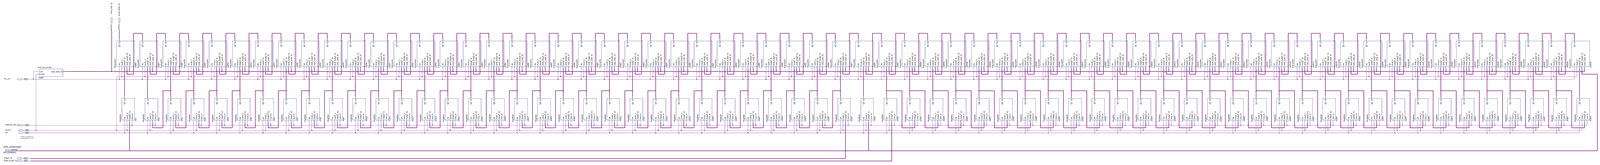
[diagram p0: schematic sheet, whole]
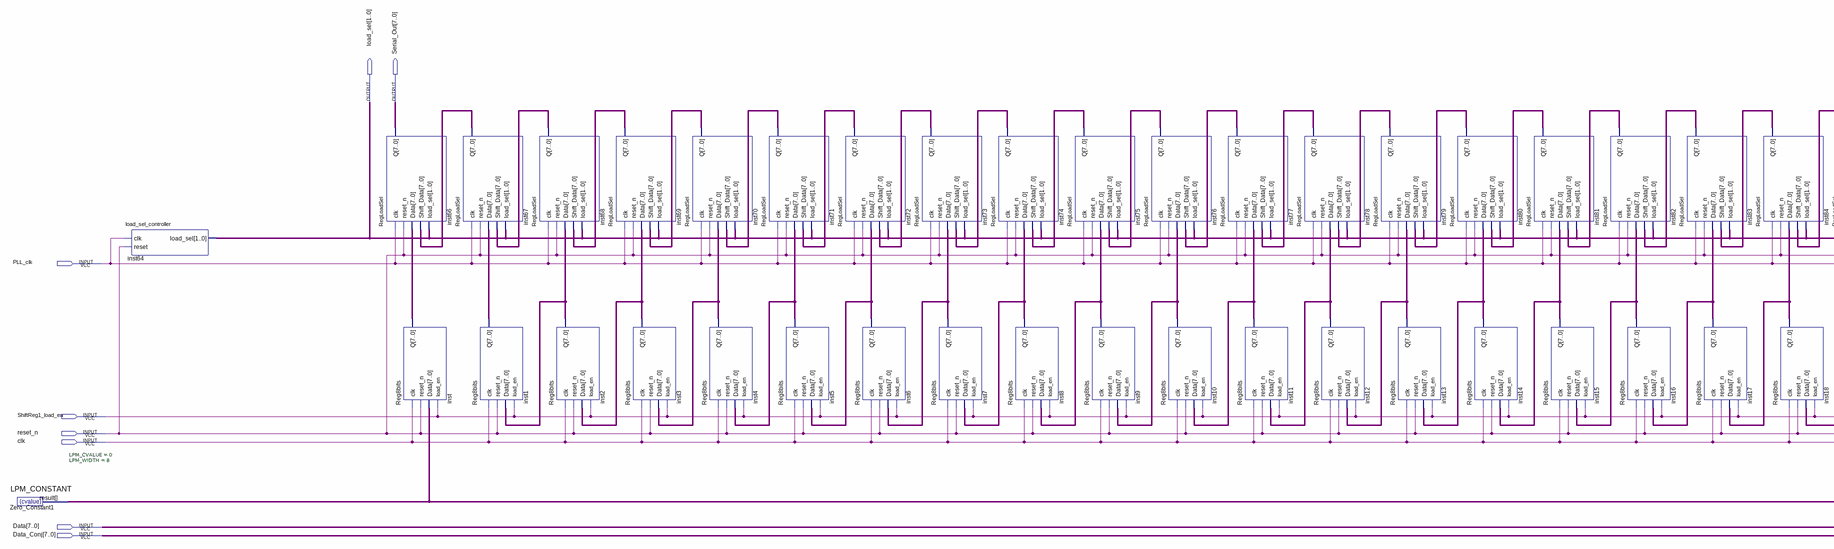
[diagram p1: schematic sheet, left part]
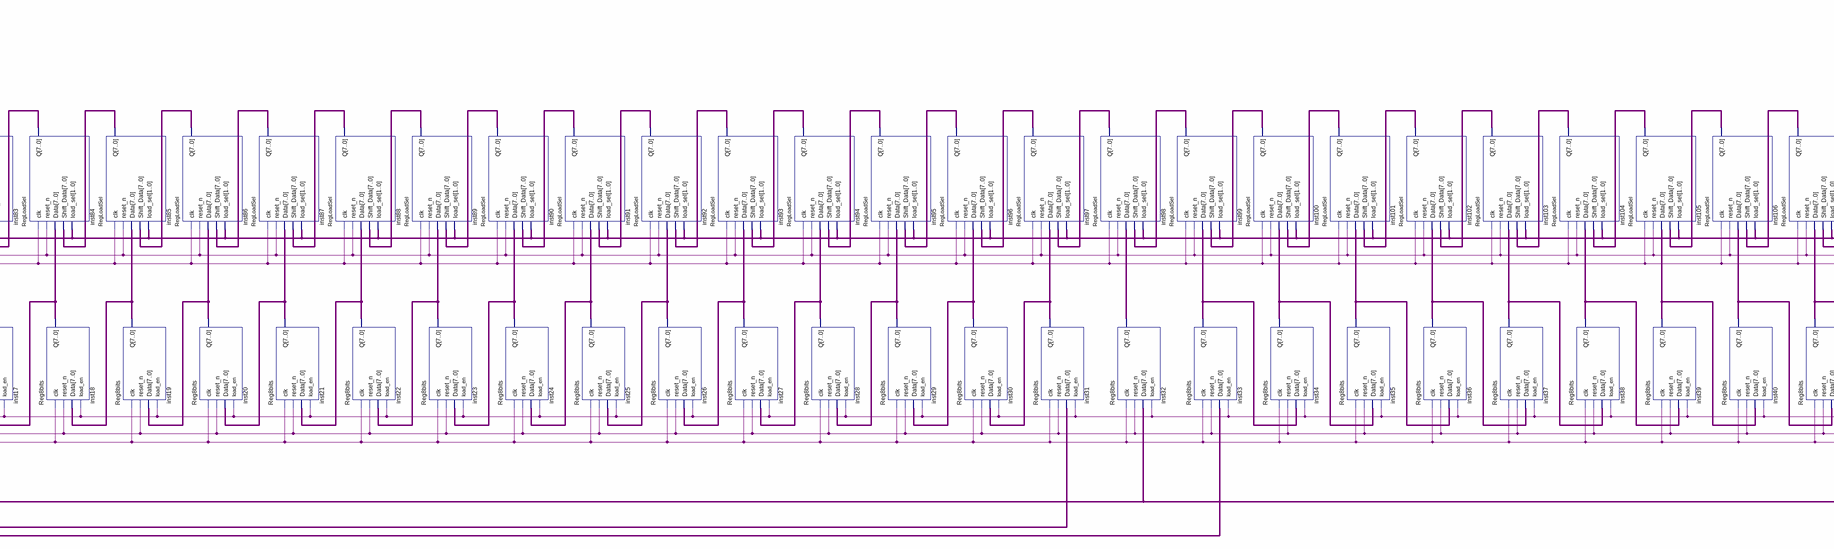
[diagram p2: schematic sheet, centre part]
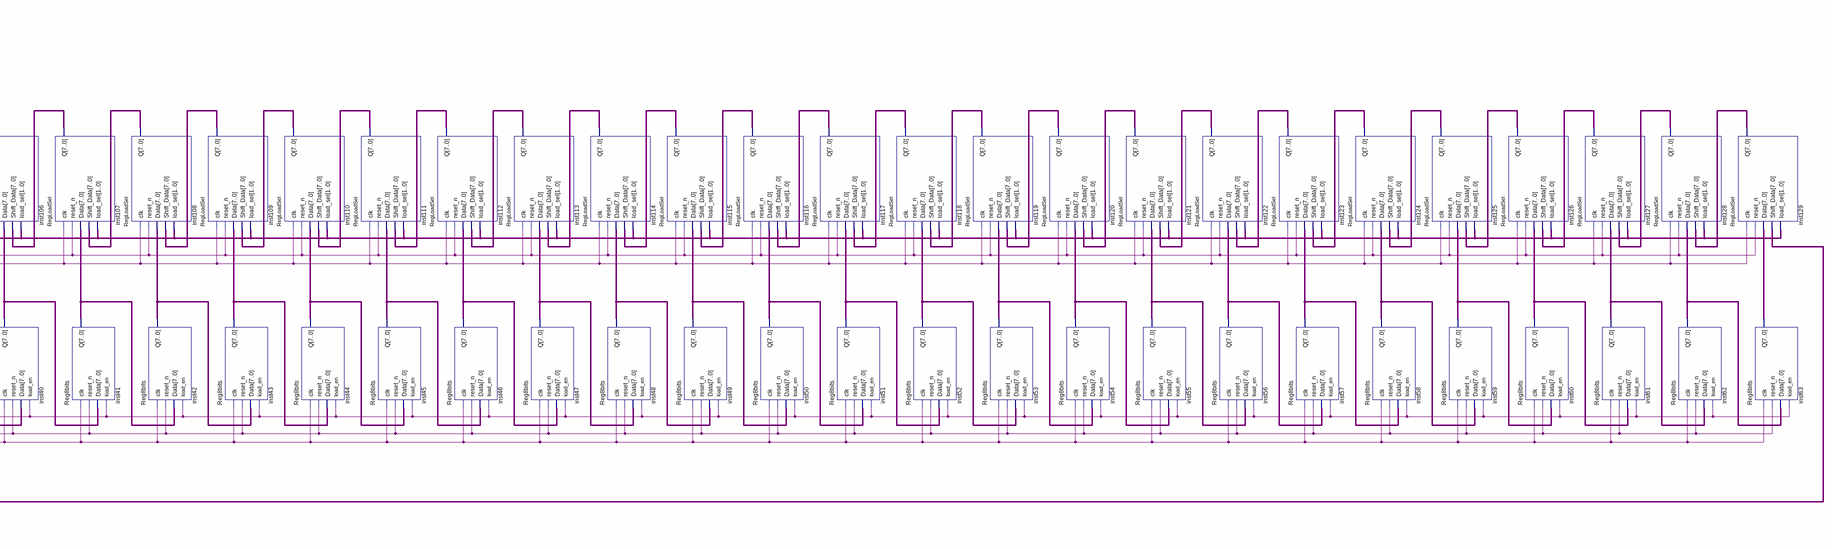
[diagram p3: schematic sheet, right part]
// Quartus schematic Sorter.bdf as structural Verilog: 130 symbols, 8 pins
module Sorter (
  input  PLL_clk,
  input  ShiftReg1_load_en,
  input  reset_n,
  input  clk,
  input  [7:0] Data,
  input  [7:0] Data_Conj,
  output [1:0] load_sel,
  output [7:0] Serial_Out
);

  wire [7:0] inst1_q, inst2_q, inst3_q, inst4_q, inst5_q, inst6_q, inst7_q, inst8_q, inst9_q, inst10_q,
       inst11_q, inst12_q, inst13_q, inst14_q, inst15_q, inst16_q, inst17_q, inst18_q, inst19_q, inst20_q,
       inst21_q, inst22_q, inst23_q, inst24_q, inst25_q, inst26_q, inst27_q, inst28_q, inst29_q, inst30_q,
       inst31_q, inst32_q, inst33_q, inst34_q, inst35_q, inst36_q, inst37_q, inst38_q, inst39_q, inst40_q,
       inst41_q, inst42_q, inst43_q, inst44_q, inst45_q, inst46_q, inst47_q, inst48_q, inst49_q, inst50_q,
       inst51_q, inst52_q, inst53_q, inst54_q, inst55_q, inst56_q, inst57_q, inst58_q, inst59_q, inst60_q,
       inst61_q, inst62_q, inst63_q, inst67_q, inst68_q, inst69_q, inst70_q, inst71_q, inst72_q, inst73_q,
       inst74_q, inst75_q, inst76_q, inst77_q, inst78_q, inst79_q, inst80_q, inst81_q, inst82_q, inst83_q,
       inst84_q, inst85_q, inst86_q, inst87_q, inst88_q, inst89_q, inst90_q, inst91_q, inst92_q, inst93_q,
       inst94_q, inst95_q, inst96_q, inst97_q, inst98_q, inst99_q, inst100_q, inst101_q, inst102_q,
       inst103_q, inst104_q, inst105_q, inst106_q, inst107_q, inst108_q, inst109_q, inst110_q, inst111_q,
       inst112_q, inst113_q, inst114_q, inst115_q, inst116_q, inst117_q, inst118_q, inst119_q, inst120_q,
       inst121_q, inst122_q, inst123_q, inst124_q, inst125_q, inst126_q, inst127_q, inst128_q, inst129_q,
       inst_q, Zero_Constant1_result;

  LPM_CONSTANT #(.LPM_CVALUE(0), .LPM_WIDTH(8)) Zero_Constant1 (.result(Zero_Constant1_result));
  load_sel_controller inst64 (.clk(PLL_clk), .reset(reset_n), .load_sel(load_sel));
  RegLoadSel inst66 (
    .clk(PLL_clk), .reset_n(reset_n), .Data(inst_q), .Shift_Data(inst67_q), .load_sel(load_sel),
    .Q(Serial_Out));
  Reg8bits inst (.clk(clk), .reset_n(reset_n), .Data(Zero_Constant1_result), .load_en(ShiftReg1_load_en), .Q(inst_q));
  RegLoadSel inst67 (
    .clk(PLL_clk), .reset_n(reset_n), .Data(inst1_q), .Shift_Data(inst68_q), .load_sel(load_sel), .Q(inst67_q));
  Reg8bits inst1 (.clk(clk), .reset_n(reset_n), .Data(inst2_q), .load_en(ShiftReg1_load_en), .Q(inst1_q));
  RegLoadSel inst68 (
    .clk(PLL_clk), .reset_n(reset_n), .Data(inst2_q), .Shift_Data(inst69_q), .load_sel(load_sel), .Q(inst68_q));
  Reg8bits inst2 (.clk(clk), .reset_n(reset_n), .Data(inst3_q), .load_en(ShiftReg1_load_en), .Q(inst2_q));
  RegLoadSel inst69 (
    .clk(PLL_clk), .reset_n(reset_n), .Data(inst3_q), .Shift_Data(inst70_q), .load_sel(load_sel), .Q(inst69_q));
  Reg8bits inst3 (.clk(clk), .reset_n(reset_n), .Data(inst4_q), .load_en(ShiftReg1_load_en), .Q(inst3_q));
  RegLoadSel inst70 (
    .clk(PLL_clk), .reset_n(reset_n), .Data(inst4_q), .Shift_Data(inst71_q), .load_sel(load_sel), .Q(inst70_q));
  Reg8bits inst4 (.clk(clk), .reset_n(reset_n), .Data(inst5_q), .load_en(ShiftReg1_load_en), .Q(inst4_q));
  RegLoadSel inst71 (
    .clk(PLL_clk), .reset_n(reset_n), .Data(inst5_q), .Shift_Data(inst72_q), .load_sel(load_sel), .Q(inst71_q));
  Reg8bits inst5 (.clk(clk), .reset_n(reset_n), .Data(inst6_q), .load_en(ShiftReg1_load_en), .Q(inst5_q));
  RegLoadSel inst72 (
    .clk(PLL_clk), .reset_n(reset_n), .Data(inst6_q), .Shift_Data(inst73_q), .load_sel(load_sel), .Q(inst72_q));
  Reg8bits inst6 (.clk(clk), .reset_n(reset_n), .Data(inst7_q), .load_en(ShiftReg1_load_en), .Q(inst6_q));
  RegLoadSel inst73 (
    .clk(PLL_clk), .reset_n(reset_n), .Data(inst7_q), .Shift_Data(inst74_q), .load_sel(load_sel), .Q(inst73_q));
  Reg8bits inst7 (.clk(clk), .reset_n(reset_n), .Data(inst8_q), .load_en(ShiftReg1_load_en), .Q(inst7_q));
  RegLoadSel inst74 (
    .clk(PLL_clk), .reset_n(reset_n), .Data(inst8_q), .Shift_Data(inst75_q), .load_sel(load_sel), .Q(inst74_q));
  Reg8bits inst8 (.clk(clk), .reset_n(reset_n), .Data(inst9_q), .load_en(ShiftReg1_load_en), .Q(inst8_q));
  RegLoadSel inst75 (
    .clk(PLL_clk), .reset_n(reset_n), .Data(inst9_q), .Shift_Data(inst76_q), .load_sel(load_sel), .Q(inst75_q));
  Reg8bits inst9 (.clk(clk), .reset_n(reset_n), .Data(inst10_q), .load_en(ShiftReg1_load_en), .Q(inst9_q));
  RegLoadSel inst76 (
    .clk(PLL_clk), .reset_n(reset_n), .Data(inst10_q), .Shift_Data(inst77_q), .load_sel(load_sel),
    .Q(inst76_q));
  Reg8bits inst10 (.clk(clk), .reset_n(reset_n), .Data(inst11_q), .load_en(ShiftReg1_load_en), .Q(inst10_q));
  RegLoadSel inst77 (
    .clk(PLL_clk), .reset_n(reset_n), .Data(inst11_q), .Shift_Data(inst78_q), .load_sel(load_sel),
    .Q(inst77_q));
  Reg8bits inst11 (.clk(clk), .reset_n(reset_n), .Data(inst12_q), .load_en(ShiftReg1_load_en), .Q(inst11_q));
  RegLoadSel inst78 (
    .clk(PLL_clk), .reset_n(reset_n), .Data(inst12_q), .Shift_Data(inst79_q), .load_sel(load_sel),
    .Q(inst78_q));
  Reg8bits inst12 (.clk(clk), .reset_n(reset_n), .Data(inst13_q), .load_en(ShiftReg1_load_en), .Q(inst12_q));
  RegLoadSel inst79 (
    .clk(PLL_clk), .reset_n(reset_n), .Data(inst13_q), .Shift_Data(inst80_q), .load_sel(load_sel),
    .Q(inst79_q));
  Reg8bits inst13 (.clk(clk), .reset_n(reset_n), .Data(inst14_q), .load_en(ShiftReg1_load_en), .Q(inst13_q));
  RegLoadSel inst80 (
    .clk(PLL_clk), .reset_n(reset_n), .Data(inst14_q), .Shift_Data(inst81_q), .load_sel(load_sel),
    .Q(inst80_q));
  Reg8bits inst14 (.clk(clk), .reset_n(reset_n), .Data(inst15_q), .load_en(ShiftReg1_load_en), .Q(inst14_q));
  RegLoadSel inst81 (
    .clk(PLL_clk), .reset_n(reset_n), .Data(inst15_q), .Shift_Data(inst82_q), .load_sel(load_sel),
    .Q(inst81_q));
  Reg8bits inst15 (.clk(clk), .reset_n(reset_n), .Data(inst16_q), .load_en(ShiftReg1_load_en), .Q(inst15_q));
  RegLoadSel inst82 (
    .clk(PLL_clk), .reset_n(reset_n), .Data(inst16_q), .Shift_Data(inst83_q), .load_sel(load_sel),
    .Q(inst82_q));
  Reg8bits inst16 (.clk(clk), .reset_n(reset_n), .Data(inst17_q), .load_en(ShiftReg1_load_en), .Q(inst16_q));
  RegLoadSel inst83 (
    .clk(PLL_clk), .reset_n(reset_n), .Data(inst17_q), .Shift_Data(inst84_q), .load_sel(load_sel),
    .Q(inst83_q));
  Reg8bits inst17 (.clk(clk), .reset_n(reset_n), .Data(inst18_q), .load_en(ShiftReg1_load_en), .Q(inst17_q));
  RegLoadSel inst84 (
    .clk(PLL_clk), .reset_n(reset_n), .Data(inst18_q), .Shift_Data(inst85_q), .load_sel(load_sel),
    .Q(inst84_q));
  Reg8bits inst18 (.clk(clk), .reset_n(reset_n), .Data(inst19_q), .load_en(ShiftReg1_load_en), .Q(inst18_q));
  RegLoadSel inst85 (
    .clk(PLL_clk), .reset_n(reset_n), .Data(inst19_q), .Shift_Data(inst86_q), .load_sel(load_sel),
    .Q(inst85_q));
  Reg8bits inst19 (.clk(clk), .reset_n(reset_n), .Data(inst20_q), .load_en(ShiftReg1_load_en), .Q(inst19_q));
  RegLoadSel inst86 (
    .clk(PLL_clk), .reset_n(reset_n), .Data(inst20_q), .Shift_Data(inst87_q), .load_sel(load_sel),
    .Q(inst86_q));
  Reg8bits inst20 (.clk(clk), .reset_n(reset_n), .Data(inst21_q), .load_en(ShiftReg1_load_en), .Q(inst20_q));
  RegLoadSel inst87 (
    .clk(PLL_clk), .reset_n(reset_n), .Data(inst21_q), .Shift_Data(inst88_q), .load_sel(load_sel),
    .Q(inst87_q));
  Reg8bits inst21 (.clk(clk), .reset_n(reset_n), .Data(inst22_q), .load_en(ShiftReg1_load_en), .Q(inst21_q));
  RegLoadSel inst88 (
    .clk(PLL_clk), .reset_n(reset_n), .Data(inst22_q), .Shift_Data(inst89_q), .load_sel(load_sel),
    .Q(inst88_q));
  Reg8bits inst22 (.clk(clk), .reset_n(reset_n), .Data(inst23_q), .load_en(ShiftReg1_load_en), .Q(inst22_q));
  RegLoadSel inst89 (
    .clk(PLL_clk), .reset_n(reset_n), .Data(inst23_q), .Shift_Data(inst90_q), .load_sel(load_sel),
    .Q(inst89_q));
  Reg8bits inst23 (.clk(clk), .reset_n(reset_n), .Data(inst24_q), .load_en(ShiftReg1_load_en), .Q(inst23_q));
  RegLoadSel inst90 (
    .clk(PLL_clk), .reset_n(reset_n), .Data(inst24_q), .Shift_Data(inst91_q), .load_sel(load_sel),
    .Q(inst90_q));
  Reg8bits inst24 (.clk(clk), .reset_n(reset_n), .Data(inst25_q), .load_en(ShiftReg1_load_en), .Q(inst24_q));
  RegLoadSel inst91 (
    .clk(PLL_clk), .reset_n(reset_n), .Data(inst25_q), .Shift_Data(inst92_q), .load_sel(load_sel),
    .Q(inst91_q));
  Reg8bits inst25 (.clk(clk), .reset_n(reset_n), .Data(inst26_q), .load_en(ShiftReg1_load_en), .Q(inst25_q));
  RegLoadSel inst92 (
    .clk(PLL_clk), .reset_n(reset_n), .Data(inst26_q), .Shift_Data(inst93_q), .load_sel(load_sel),
    .Q(inst92_q));
  Reg8bits inst26 (.clk(clk), .reset_n(reset_n), .Data(inst27_q), .load_en(ShiftReg1_load_en), .Q(inst26_q));
  RegLoadSel inst93 (
    .clk(PLL_clk), .reset_n(reset_n), .Data(inst27_q), .Shift_Data(inst94_q), .load_sel(load_sel),
    .Q(inst93_q));
  Reg8bits inst27 (.clk(clk), .reset_n(reset_n), .Data(inst28_q), .load_en(ShiftReg1_load_en), .Q(inst27_q));
  RegLoadSel inst94 (
    .clk(PLL_clk), .reset_n(reset_n), .Data(inst28_q), .Shift_Data(inst95_q), .load_sel(load_sel),
    .Q(inst94_q));
  Reg8bits inst28 (.clk(clk), .reset_n(reset_n), .Data(inst29_q), .load_en(ShiftReg1_load_en), .Q(inst28_q));
  RegLoadSel inst95 (
    .clk(PLL_clk), .reset_n(reset_n), .Data(inst29_q), .Shift_Data(inst96_q), .load_sel(load_sel),
    .Q(inst95_q));
  Reg8bits inst29 (.clk(clk), .reset_n(reset_n), .Data(inst30_q), .load_en(ShiftReg1_load_en), .Q(inst29_q));
  RegLoadSel inst96 (
    .clk(PLL_clk), .reset_n(reset_n), .Data(inst30_q), .Shift_Data(inst97_q), .load_sel(load_sel),
    .Q(inst96_q));
  Reg8bits inst30 (.clk(clk), .reset_n(reset_n), .Data(inst31_q), .load_en(ShiftReg1_load_en), .Q(inst30_q));
  RegLoadSel inst97 (
    .clk(PLL_clk), .reset_n(reset_n), .Data(inst31_q), .Shift_Data(inst98_q), .load_sel(load_sel),
    .Q(inst97_q));
  Reg8bits inst31 (.clk(clk), .reset_n(reset_n), .Data(Data), .load_en(ShiftReg1_load_en), .Q(inst31_q));
  RegLoadSel inst98 (
    .clk(PLL_clk), .reset_n(reset_n), .Data(inst32_q), .Shift_Data(inst99_q), .load_sel(load_sel),
    .Q(inst98_q));
  Reg8bits inst32 (
    .clk(clk), .reset_n(reset_n), .Data(Zero_Constant1_result), .load_en(ShiftReg1_load_en), .Q(inst32_q));
  RegLoadSel inst99 (
    .clk(PLL_clk), .reset_n(reset_n), .Data(inst33_q), .Shift_Data(inst100_q), .load_sel(load_sel),
    .Q(inst99_q));
  Reg8bits inst33 (.clk(clk), .reset_n(reset_n), .Data(Data_Conj), .load_en(ShiftReg1_load_en), .Q(inst33_q));
  RegLoadSel inst100 (
    .clk(PLL_clk), .reset_n(reset_n), .Data(inst34_q), .Shift_Data(inst101_q), .load_sel(load_sel),
    .Q(inst100_q));
  Reg8bits inst34 (.clk(clk), .reset_n(reset_n), .Data(inst33_q), .load_en(ShiftReg1_load_en), .Q(inst34_q));
  RegLoadSel inst101 (
    .clk(PLL_clk), .reset_n(reset_n), .Data(inst35_q), .Shift_Data(inst102_q), .load_sel(load_sel),
    .Q(inst101_q));
  Reg8bits inst35 (.clk(clk), .reset_n(reset_n), .Data(inst34_q), .load_en(ShiftReg1_load_en), .Q(inst35_q));
  RegLoadSel inst102 (
    .clk(PLL_clk), .reset_n(reset_n), .Data(inst36_q), .Shift_Data(inst103_q), .load_sel(load_sel),
    .Q(inst102_q));
  Reg8bits inst36 (.clk(clk), .reset_n(reset_n), .Data(inst35_q), .load_en(ShiftReg1_load_en), .Q(inst36_q));
  RegLoadSel inst103 (
    .clk(PLL_clk), .reset_n(reset_n), .Data(inst37_q), .Shift_Data(inst104_q), .load_sel(load_sel),
    .Q(inst103_q));
  Reg8bits inst37 (.clk(clk), .reset_n(reset_n), .Data(inst36_q), .load_en(ShiftReg1_load_en), .Q(inst37_q));
  RegLoadSel inst104 (
    .clk(PLL_clk), .reset_n(reset_n), .Data(inst38_q), .Shift_Data(inst105_q), .load_sel(load_sel),
    .Q(inst104_q));
  Reg8bits inst38 (.clk(clk), .reset_n(reset_n), .Data(inst37_q), .load_en(ShiftReg1_load_en), .Q(inst38_q));
  RegLoadSel inst105 (
    .clk(PLL_clk), .reset_n(reset_n), .Data(inst39_q), .Shift_Data(inst106_q), .load_sel(load_sel),
    .Q(inst105_q));
  Reg8bits inst39 (.clk(clk), .reset_n(reset_n), .Data(inst38_q), .load_en(ShiftReg1_load_en), .Q(inst39_q));
  RegLoadSel inst106 (
    .clk(PLL_clk), .reset_n(reset_n), .Data(inst40_q), .Shift_Data(inst107_q), .load_sel(load_sel),
    .Q(inst106_q));
  Reg8bits inst40 (.clk(clk), .reset_n(reset_n), .Data(inst39_q), .load_en(ShiftReg1_load_en), .Q(inst40_q));
  RegLoadSel inst107 (
    .clk(PLL_clk), .reset_n(reset_n), .Data(inst41_q), .Shift_Data(inst108_q), .load_sel(load_sel),
    .Q(inst107_q));
  Reg8bits inst41 (.clk(clk), .reset_n(reset_n), .Data(inst40_q), .load_en(ShiftReg1_load_en), .Q(inst41_q));
  RegLoadSel inst108 (
    .clk(PLL_clk), .reset_n(reset_n), .Data(inst42_q), .Shift_Data(inst109_q), .load_sel(load_sel),
    .Q(inst108_q));
  Reg8bits inst42 (.clk(clk), .reset_n(reset_n), .Data(inst41_q), .load_en(ShiftReg1_load_en), .Q(inst42_q));
  RegLoadSel inst109 (
    .clk(PLL_clk), .reset_n(reset_n), .Data(inst43_q), .Shift_Data(inst110_q), .load_sel(load_sel),
    .Q(inst109_q));
  Reg8bits inst43 (.clk(clk), .reset_n(reset_n), .Data(inst42_q), .load_en(ShiftReg1_load_en), .Q(inst43_q));
  RegLoadSel inst110 (
    .clk(PLL_clk), .reset_n(reset_n), .Data(inst44_q), .Shift_Data(inst111_q), .load_sel(load_sel),
    .Q(inst110_q));
  Reg8bits inst44 (.clk(clk), .reset_n(reset_n), .Data(inst43_q), .load_en(ShiftReg1_load_en), .Q(inst44_q));
  RegLoadSel inst111 (
    .clk(PLL_clk), .reset_n(reset_n), .Data(inst45_q), .Shift_Data(inst112_q), .load_sel(load_sel),
    .Q(inst111_q));
  Reg8bits inst45 (.clk(clk), .reset_n(reset_n), .Data(inst44_q), .load_en(ShiftReg1_load_en), .Q(inst45_q));
  RegLoadSel inst112 (
    .clk(PLL_clk), .reset_n(reset_n), .Data(inst46_q), .Shift_Data(inst113_q), .load_sel(load_sel),
    .Q(inst112_q));
  Reg8bits inst46 (.clk(clk), .reset_n(reset_n), .Data(inst45_q), .load_en(ShiftReg1_load_en), .Q(inst46_q));
  RegLoadSel inst113 (
    .clk(PLL_clk), .reset_n(reset_n), .Data(inst47_q), .Shift_Data(inst114_q), .load_sel(load_sel),
    .Q(inst113_q));
  Reg8bits inst47 (.clk(clk), .reset_n(reset_n), .Data(inst46_q), .load_en(ShiftReg1_load_en), .Q(inst47_q));
  RegLoadSel inst114 (
    .clk(PLL_clk), .reset_n(reset_n), .Data(inst48_q), .Shift_Data(inst115_q), .load_sel(load_sel),
    .Q(inst114_q));
  Reg8bits inst48 (.clk(clk), .reset_n(reset_n), .Data(inst47_q), .load_en(ShiftReg1_load_en), .Q(inst48_q));
  RegLoadSel inst115 (
    .clk(PLL_clk), .reset_n(reset_n), .Data(inst49_q), .Shift_Data(inst116_q), .load_sel(load_sel),
    .Q(inst115_q));
  Reg8bits inst49 (.clk(clk), .reset_n(reset_n), .Data(inst48_q), .load_en(ShiftReg1_load_en), .Q(inst49_q));
  RegLoadSel inst116 (
    .clk(PLL_clk), .reset_n(reset_n), .Data(inst50_q), .Shift_Data(inst117_q), .load_sel(load_sel),
    .Q(inst116_q));
  Reg8bits inst50 (.clk(clk), .reset_n(reset_n), .Data(inst49_q), .load_en(ShiftReg1_load_en), .Q(inst50_q));
  RegLoadSel inst117 (
    .clk(PLL_clk), .reset_n(reset_n), .Data(inst51_q), .Shift_Data(inst118_q), .load_sel(load_sel),
    .Q(inst117_q));
  Reg8bits inst51 (.clk(clk), .reset_n(reset_n), .Data(inst50_q), .load_en(ShiftReg1_load_en), .Q(inst51_q));
  RegLoadSel inst118 (
    .clk(PLL_clk), .reset_n(reset_n), .Data(inst52_q), .Shift_Data(inst119_q), .load_sel(load_sel),
    .Q(inst118_q));
  Reg8bits inst52 (.clk(clk), .reset_n(reset_n), .Data(inst51_q), .load_en(ShiftReg1_load_en), .Q(inst52_q));
  RegLoadSel inst119 (
    .clk(PLL_clk), .reset_n(reset_n), .Data(inst53_q), .Shift_Data(inst120_q), .load_sel(load_sel),
    .Q(inst119_q));
  Reg8bits inst53 (.clk(clk), .reset_n(reset_n), .Data(inst52_q), .load_en(ShiftReg1_load_en), .Q(inst53_q));
  RegLoadSel inst120 (
    .clk(PLL_clk), .reset_n(reset_n), .Data(inst54_q), .Shift_Data(inst121_q), .load_sel(load_sel),
    .Q(inst120_q));
  Reg8bits inst54 (.clk(clk), .reset_n(reset_n), .Data(inst53_q), .load_en(ShiftReg1_load_en), .Q(inst54_q));
  RegLoadSel inst121 (
    .clk(PLL_clk), .reset_n(reset_n), .Data(inst55_q), .Shift_Data(inst122_q), .load_sel(load_sel),
    .Q(inst121_q));
  Reg8bits inst55 (.clk(clk), .reset_n(reset_n), .Data(inst54_q), .load_en(ShiftReg1_load_en), .Q(inst55_q));
  RegLoadSel inst122 (
    .clk(PLL_clk), .reset_n(reset_n), .Data(inst56_q), .Shift_Data(inst123_q), .load_sel(load_sel),
    .Q(inst122_q));
  Reg8bits inst56 (.clk(clk), .reset_n(reset_n), .Data(inst55_q), .load_en(ShiftReg1_load_en), .Q(inst56_q));
  RegLoadSel inst123 (
    .clk(PLL_clk), .reset_n(reset_n), .Data(inst57_q), .Shift_Data(inst124_q), .load_sel(load_sel),
    .Q(inst123_q));
  Reg8bits inst57 (.clk(clk), .reset_n(reset_n), .Data(inst56_q), .load_en(ShiftReg1_load_en), .Q(inst57_q));
  RegLoadSel inst124 (
    .clk(PLL_clk), .reset_n(reset_n), .Data(inst58_q), .Shift_Data(inst125_q), .load_sel(load_sel),
    .Q(inst124_q));
  Reg8bits inst58 (.clk(clk), .reset_n(reset_n), .Data(inst57_q), .load_en(ShiftReg1_load_en), .Q(inst58_q));
  RegLoadSel inst125 (
    .clk(PLL_clk), .reset_n(reset_n), .Data(inst59_q), .Shift_Data(inst126_q), .load_sel(load_sel),
    .Q(inst125_q));
  Reg8bits inst59 (.clk(clk), .reset_n(reset_n), .Data(inst58_q), .load_en(ShiftReg1_load_en), .Q(inst59_q));
  RegLoadSel inst126 (
    .clk(PLL_clk), .reset_n(reset_n), .Data(inst60_q), .Shift_Data(inst127_q), .load_sel(load_sel),
    .Q(inst126_q));
  Reg8bits inst60 (.clk(clk), .reset_n(reset_n), .Data(inst59_q), .load_en(ShiftReg1_load_en), .Q(inst60_q));
  RegLoadSel inst127 (
    .clk(PLL_clk), .reset_n(reset_n), .Data(inst61_q), .Shift_Data(inst128_q), .load_sel(load_sel),
    .Q(inst127_q));
  Reg8bits inst61 (.clk(clk), .reset_n(reset_n), .Data(inst60_q), .load_en(ShiftReg1_load_en), .Q(inst61_q));
  RegLoadSel inst128 (
    .clk(PLL_clk), .reset_n(reset_n), .Data(inst62_q), .Shift_Data(inst129_q), .load_sel(load_sel),
    .Q(inst128_q));
  Reg8bits inst62 (.clk(clk), .reset_n(reset_n), .Data(inst61_q), .load_en(ShiftReg1_load_en), .Q(inst62_q));
  RegLoadSel inst129 (
    .clk(PLL_clk), .reset_n(reset_n), .Data(inst63_q), .Shift_Data(Zero_Constant1_result),
    .load_sel(load_sel), .Q(inst129_q));
  Reg8bits inst63 (.clk(clk), .reset_n(reset_n), .Data(inst62_q), .load_en(ShiftReg1_load_en), .Q(inst63_q));
endmodule
